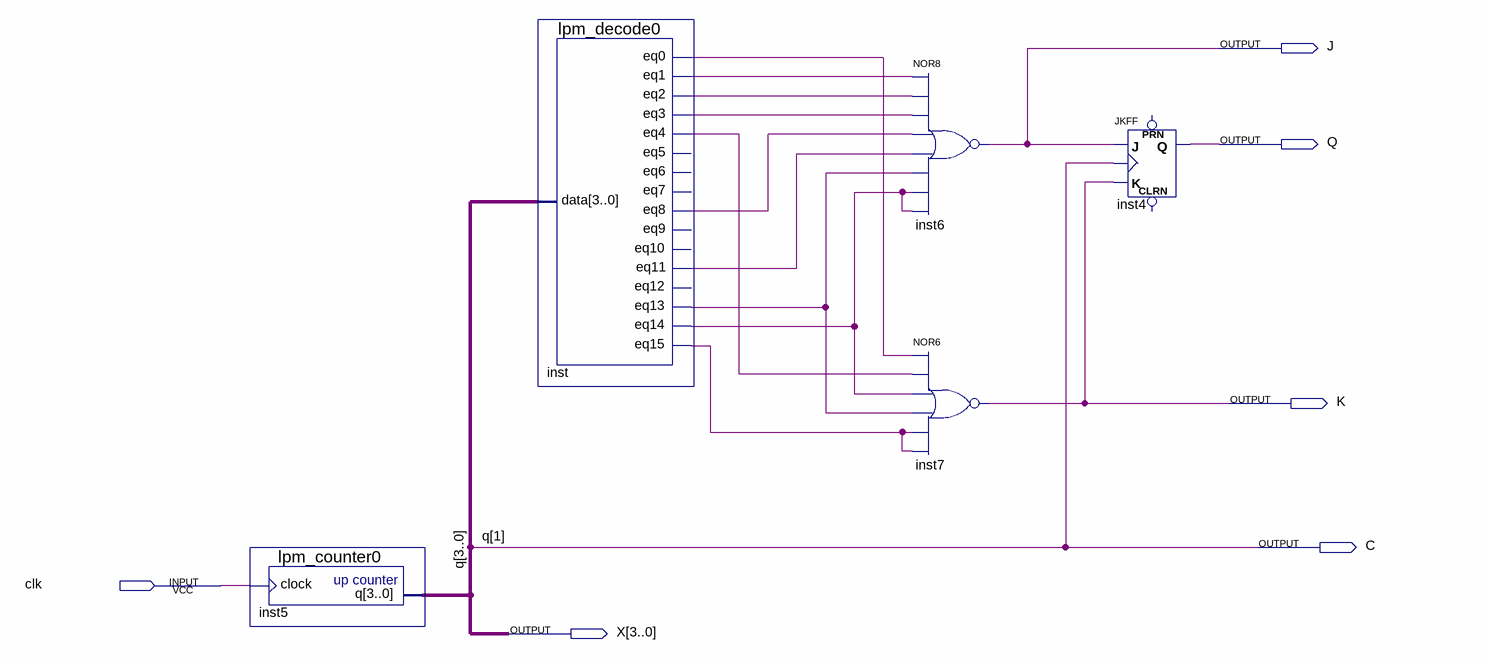
[diagram p0: schematic sheet]
// Quartus schematic jk_trig.bdf as structural Verilog: 5 symbols, 6 pins
module jk_trig (
  input  clk,
  output J,
  output Q,
  output K,
  output C,
  output [3:0] X
);

  wire inst_eq0, inst_eq1, inst_eq2, inst_eq3, inst_eq4, inst_eq8, inst_eq11, inst_eq13, inst_eq14, inst_eq15;

  lpm_counter0 inst5 (.clock(clk), .q({X[3:2], C, X[0]}));
  lpm_decode0 inst (
    .data({X[3:2], C, X[0]}), .eq0(inst_eq0), .eq1(inst_eq1), .eq2(inst_eq2), .eq3(inst_eq3), .eq4(inst_eq4),
    .eq8(inst_eq8), .eq11(inst_eq11), .eq13(inst_eq13), .eq14(inst_eq14), .eq15(inst_eq15));  // open: eq5, eq6, eq7, eq9, eq10, eq12
  nor inst6 (J, inst_eq1, inst_eq2, inst_eq3, inst_eq8, inst_eq11, inst_eq13, inst_eq14, inst_eq14);
  nor inst7 (K, inst_eq0, inst_eq4, inst_eq14, inst_eq13, inst_eq15, inst_eq15);
  JKFF inst4 (.K(K), .J(J), .CLK(C), .Q(Q));  // open: PRN, CLRN

  assign X[1] = C;

  // Other names for the same wires on the sheet: Q[3:0] = {X[3:2], C, X[0]}
endmodule
